# Altium schematic sheet Sheet1.SchDoc
size A4; PageSetup: Record=PageOptions|CenterHorizontal=True|CenterVertical=True|PrintScale=1.00|XCorrection=1.00|YCorrection=1.00|PrintKind=2|BorderSize=5000000|LeftOffset=0|BottomOffset=0|Orientation=2|PaperLength=1000|PaperWidth=1000|Scale=100|PaperSource=7|PrintQuality=-3|MediaType=1|DitherType=10|PrintScaleMode=1|PaperKind=A4|PaperIndex=9
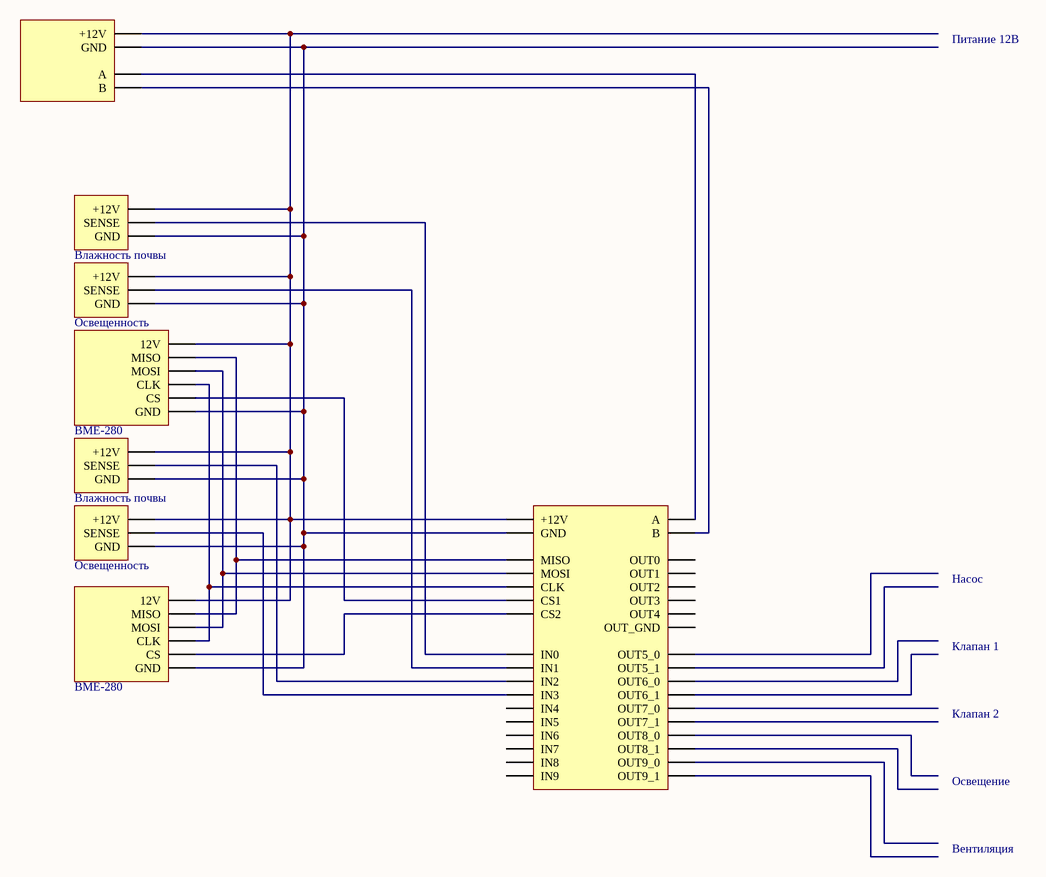
[diagram p0: Sheet1.SchDoc]

## Parts
(Parts that share a designator on the sheet are numbered #1, #2 ... from top to bottom, then left to right.)
*#1  _Subm  (value not drawn)
*#2  Влажность почвы
*#3  Освещенность
*#4  BME-280
*#5  Влажность почвы
*#6  Освещенность
*#7  BME-280
*#8  _Any  (value not drawn)

## Nets
Net*#1_34: *#1.34(+12V) *#2.65(+12V) *#3.65(+12V) *#4.66(12V) *#5.65(+12V) *#6.65(+12V) *#7.66(12V) *#8.34(+12V)
Net*#1_35: *#1.35(GND) *#2.63(GND) *#3.63(GND) *#4.71(GND) *#5.63(GND) *#6.63(GND) *#7.71(GND) *#8.35(GND)
Net*#1_36: *#1.36(A) *#8.41(A)
Net*#1_37: *#1.37(B) *#8.42(B)
Net*#2_64: *#2.64(SENSE) *#8.41(IN0)
Net*#3_64: *#3.64(SENSE) *#8.42(IN1)
Net*#4_67: *#4.67(MISO) *#7.67(MISO) *#8.36(MISO)
Net*#4_68: *#4.68(MOSI) *#7.68(MOSI) *#8.37(MOSI)
Net*#4_69: *#4.69(CLK) *#7.69(CLK) *#8.40(CLK)
Net*#4_70: *#4.70(CS) *#8.38(CS1)
Net*#5_64: *#5.64(SENSE) *#8.43(IN2)
Net*#6_64: *#6.64(SENSE) *#8.44(IN3)
Net*#7_70: *#7.70(CS) *#8.39(CS2)

Not connected (* = marked no-connect by the designer): *#8 45(IN4) 46(IN5) 47(IN6) 48(IN7) 49(IN8) 50(IN9) 52(OUT0) 53(OUT1) 54(OUT2) 55(OUT3) 56(OUT4) 57(OUT5_0) 58(OUT6_0) 59(OUT7_0) 60(OUT8_0) 61(OUT9_0) 62(OUT9_1)

## Notes on the sheet
- Питание 12В
- Насос
- Клапан 1
- Клапан 2
- Освещение
- Вентиляция

## Library data of the parts
*#2 *#3 *#5 *#6 = _soil
*#4 *#7 = _sens